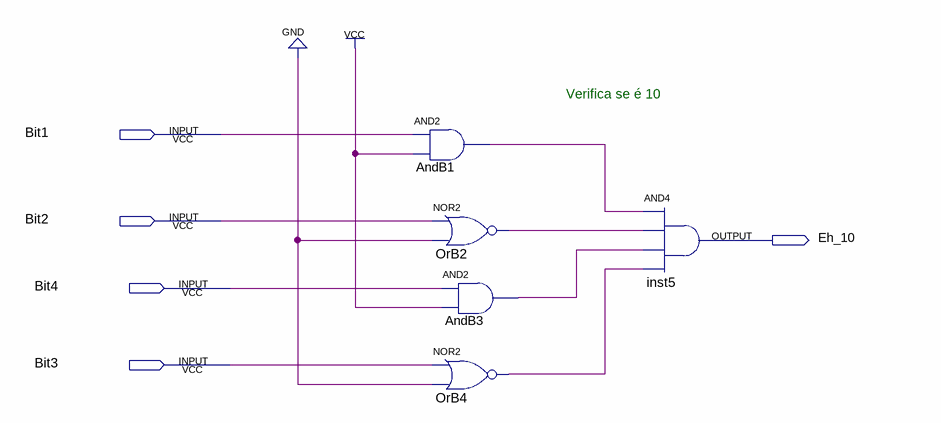
[diagram p0: schematic sheet]
// Quartus schematic Se10.bdf as structural Verilog: 5 symbols, 5 pins
module Se10 (
  input  Bit1,
  input  Bit2,
  input  Bit4,
  input  Bit3,
  output Eh_10
);

  wire AndB1_out, AndB3_out, OrB2_out, OrB4_out;

  and AndB1 (AndB1_out, Bit1, 1'b1);
  nor OrB2 (OrB2_out, Bit2, 1'b0);
  and AndB3 (AndB3_out, Bit4, 1'b1);
  nor OrB4 (OrB4_out, Bit3, 1'b0);
  // AND4 inst5 has open pins: IN1=AndB1_out, IN2=OrB2_out, IN3=AndB3_out, IN4=OrB4_out, OUT=open

  // Notes on the sheet:
  //   Verifica se é 10
endmodule
